# EAGLE design Display (EAGLE 7.7.0)
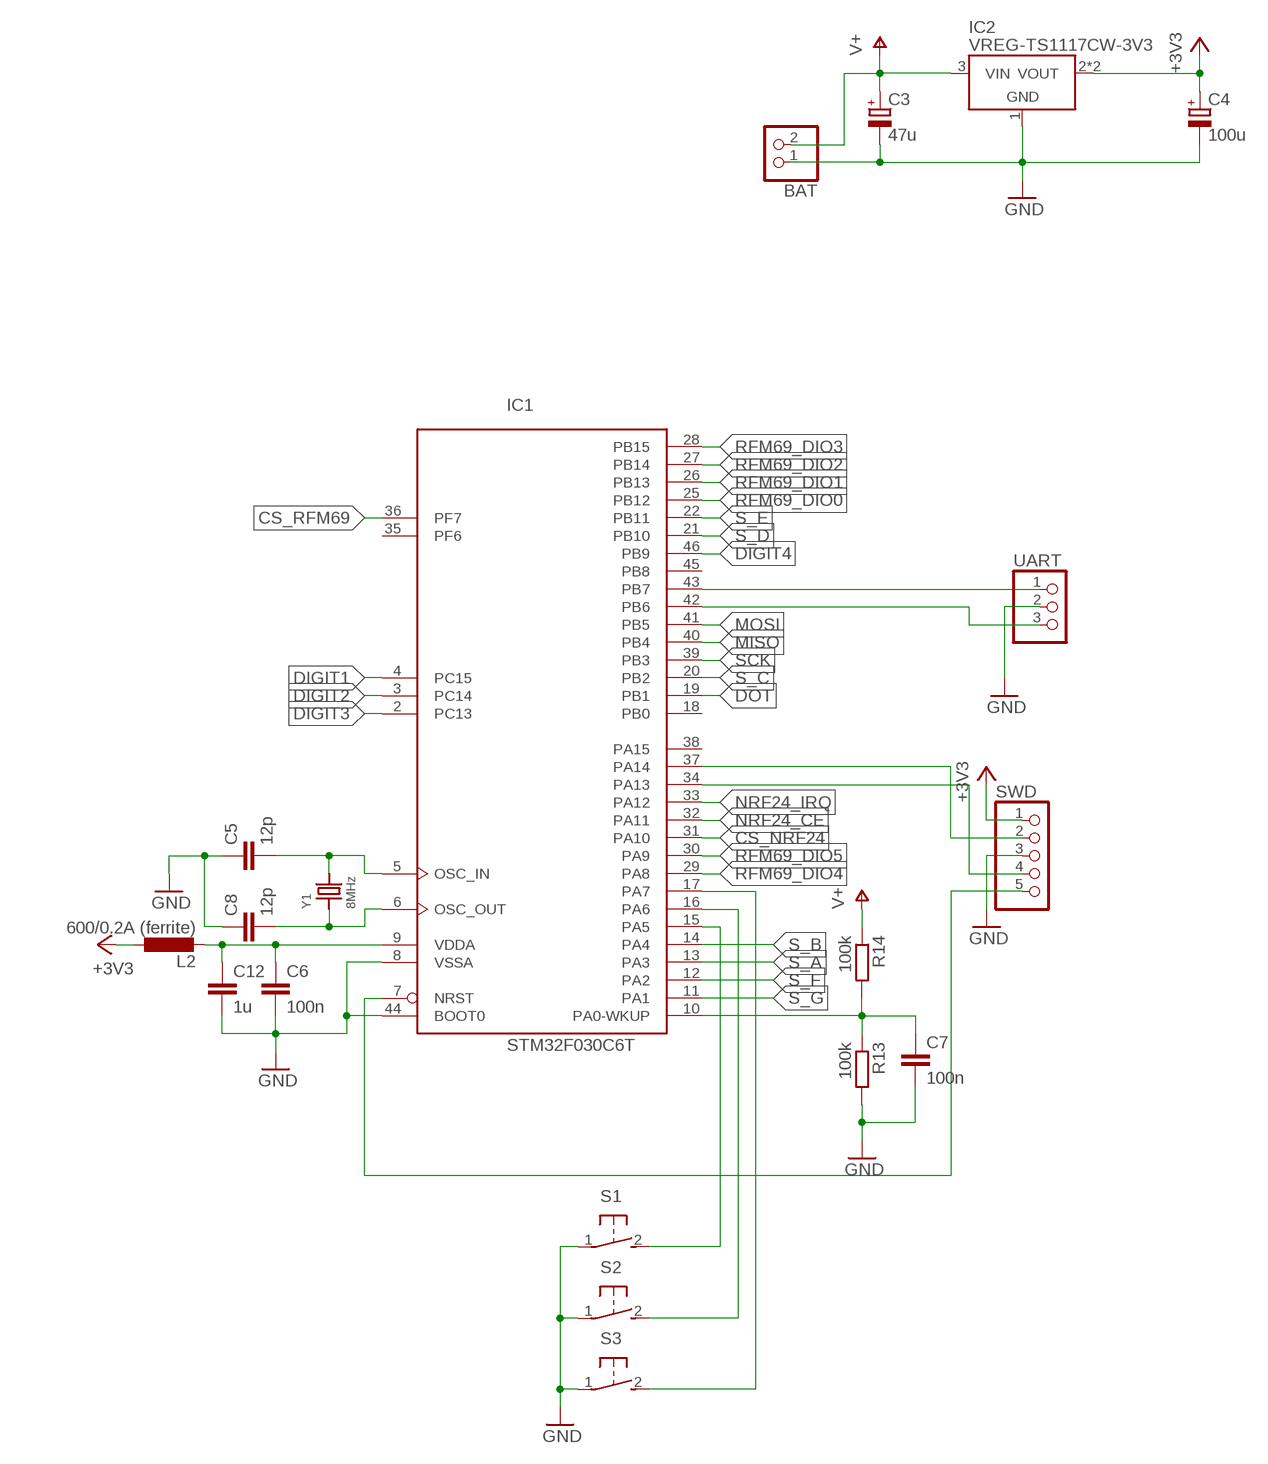
[diagram p0: schematic, sheet 1, part 1 of 2]
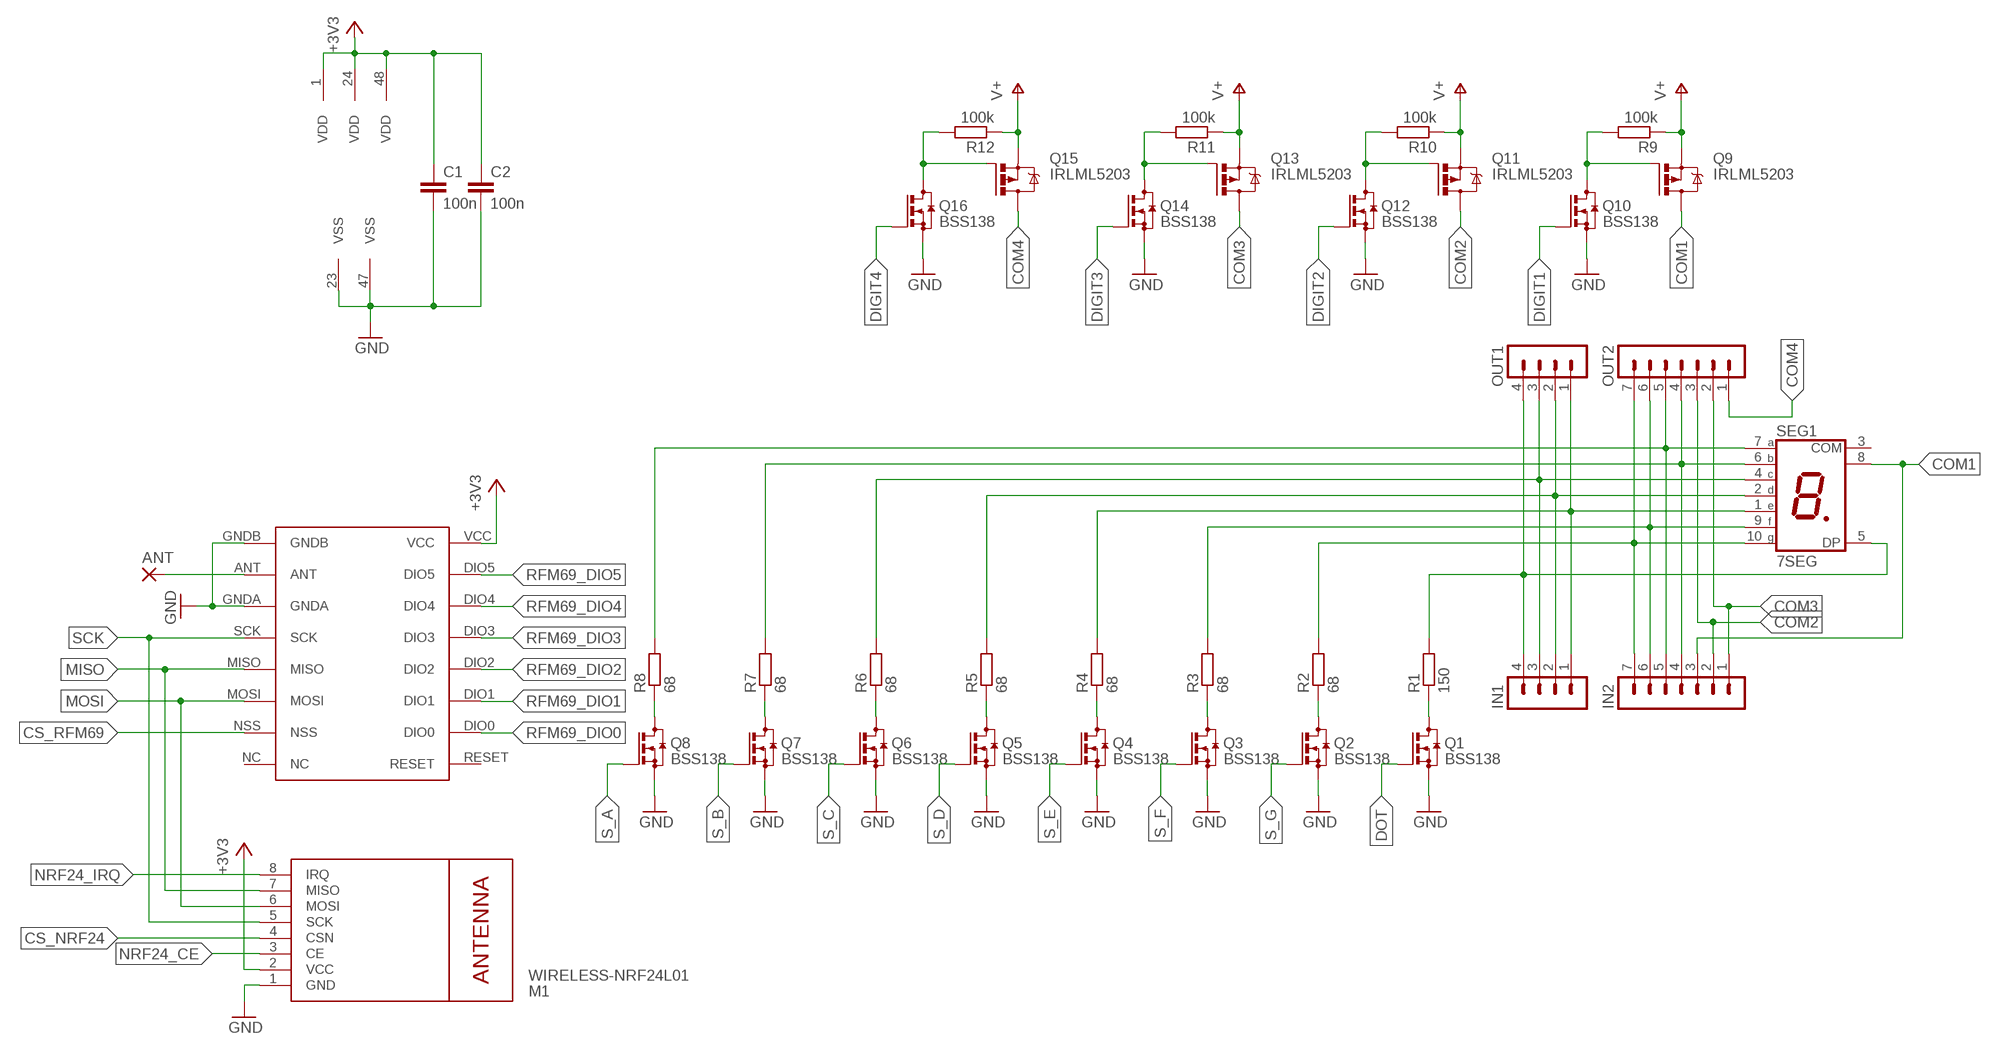
[diagram p1: schematic, sheet 1, part 2 of 2]

## Parts
ANT  1,6/0,8  [1,6/0,8]
BAT  PINHD-1X2/90  [1X02/90]
C1  100n  C-EUC0603K  [C0603K]
C2  100n  C-EUC0603K  [C0603K]
C3  47u  CPOL-EUE2.5-6  [E2,5-6]
C4  100u  CPOL-EUE2.5-6  [E2,5-6]
C5  12p  C-EUC0603  [C0603]
C6  100n  C-EUC0603  [C0603]
C7  100n  C-EUC0603  [C0603]
C8  12p  C-EUC0603  [C0603]
C12  1u  C-EUC0603  [C0603]
IC1  STM32F030C6T  [LQFP48]
IC2  VREG-TS1117CW-3V3  [SOT223]
IN1  MA04-1  [MA04-1]
IN2  MA07-1  [MA07-1]
L2  600/0.2A (ferrite)  L-EUL2012C  [L2012C]
M1  WIRELESS-NRF24L01  [WIRELESS-NRF24L01]
OUT1  MA04-1  [MA04-1]
OUT2  MA07-1  [MA07-1]
Q1  BSS138  BSS123  [SOT23]
Q2  BSS138  BSS123  [SOT23]
Q3  BSS138  BSS123  [SOT23]
Q4  BSS138  BSS123  [SOT23]
Q5  BSS138  BSS123  [SOT23]
Q6  BSS138  BSS123  [SOT23]
Q7  BSS138  BSS123  [SOT23]
Q8  BSS138  BSS123  [SOT23]
Q9  IRLML5203  [MICRO3]
Q10  BSS138  BSS123  [SOT23]
Q11  IRLML5203  [MICRO3]
Q12  BSS138  BSS123  [SOT23]
Q13  IRLML5203  [MICRO3]
Q14  BSS138  BSS123  [SOT23]
Q15  IRLML5203  [MICRO3]
Q16  BSS138  BSS123  [SOT23]
R1  150  R-EU_R1206  [R1206]
R2  68  R-EU_R1206  [R1206]
R3  68  R-EU_R1206  [R1206]
R4  68  R-EU_R1206  [R1206]
R5  68  R-EU_R1206  [R1206]
R6  68  R-EU_R1206  [R1206]
R7  68  R-EU_R1206  [R1206]
R8  68  R-EU_R1206  [R1206]
R9  100k  R-EU_R0603  [R0603]
R10  100k  R-EU_R0603  [R0603]
R11  100k  R-EU_R0603  [R0603]
R12  100k  R-EU_R0603  [R0603]
R13  100k  R-EU_R0603  [R0603]
R14  100k  R-EU_R0603  [R0603]
S1  31-XX  [B3F-31XX]
S2  31-XX  [B3F-31XX]
S3  31-XX  [B3F-31XX]
SEG1  7SEG  [7SEG_70*40]
SWD  PINHD-1X5  [1X05]
U$1  RFM69HW  [RFM]
UART  PINHD-1X3  [1X03]
Y1  8MHz  CRYSTAL.3.2X2.5MM  [3.2X2.5MM]

## Nets
+3V3: C1.1 C2.1 C4.+ IC1.1(VDD) IC1.24(VDD) IC1.48(VDD) IC2.2(VOUT) IC2.4(VOUT) L2.1 M1.2(VCC) SWD.1 U$1.VCC
ANT: ANT.1(P) U$1.ANT
COM1: IN2.3 Q9.3(D) SEG1.8(COM)
COM2: IN2.2 OUT2.3 Q11.3(D)
COM3: IN2.1 OUT2.2 Q13.3(D)
COM4: OUT2.1 Q15.3(D)
CS_NRF24: IC1.31(PA10) M1.4(CSN)
CS_RFM69: IC1.36(PF7) U$1.NSS
DIGIT1: IC1.4(PC15) Q10.1(G)
DIGIT2: IC1.3(PC14) Q12.1(G)
DIGIT3: IC1.2(PC13) Q14.1(G)
DIGIT4: IC1.46(PB9) Q16.1(G)
DOT: IC1.19(PB1) Q1.1(G)
DP: IN1.4 OUT1.4 R1.2 SEG1.5(DP)
GND: BAT.1 C1.2 C2.2 C3.- C4.- C5.1 C6.2 C7.2 C8.1 C12.2 IC1.8(VSSA) IC1.23(VSS) IC1.44(BOOT0) IC1.47(VSS) IC2.1(GND) M1.1(GND) Q1.2(S) Q2.2(S) Q3.2(S) Q4.2(S) Q5.2(S) Q6.2(S) Q7.2(S) Q8.2(S) Q10.2(S) Q12.2(S) Q14.2(S) Q16.2(S) R13.2 S1.1(P) S2.1(P) S3.1(P) SWD.3 U$1.GNDA U$1.GNDB UART.2
MISO: IC1.40(PB4) M1.7(MISO) U$1.MISO
MOSI: IC1.41(PB5) M1.6(MOSI) U$1.MOSI
N$1: Q1.3(D) R1.1
N$2: Q2.3(D) R2.1
N$3: Q3.3(D) R3.1
N$4: Q4.3(D) R4.1
N$5: Q5.3(D) R5.1
N$6: Q6.3(D) R6.1
N$7: Q7.3(D) R7.1
N$8: Q8.3(D) R8.1
N$9: Q9.1(G) Q10.3(D) R9.2
N$10: Q11.1(G) Q12.3(D) R10.2
N$11: Q13.1(G) Q14.3(D) R11.2
N$12: Q15.1(G) Q16.3(D) R12.2
N$13: C6.1 C12.1 IC1.9(VDDA) L2.2
N$14: C7.1 IC1.10(PA0-WKUP) R13.1 R14.2
N$15: C5.2 IC1.5(OSC_IN) Y1.3
N$16: IC1.15(PA5) S1.2(S)
N$17: IC1.16(PA6) S2.2(S)
N$18: IC1.17(PA7) S3.2(S)
N$19: C8.2 IC1.6(OSC_OUT) Y1.1
NRF24_CE: IC1.32(PA11) M1.3(CE)
NRF24_IRQ: IC1.33(PA12) M1.8(IRQ)
NRST: IC1.7(NRST) SWD.5
RFM69_DIO0: IC1.25(PB12) U$1.DIO0
RFM69_DIO1: IC1.26(PB13) U$1.DIO1
RFM69_DIO2: IC1.27(PB14) U$1.DIO2
RFM69_DIO3: IC1.28(PB15) U$1.DIO3
RFM69_DIO4: IC1.29(PA8) U$1.DIO4
RFM69_DIO5: IC1.30(PA9) U$1.DIO5
RX: IC1.43(PB7) UART.1
S_A: IC1.13(PA3) Q8.1(G)
S_B: IC1.14(PA4) Q7.1(G)
S_C: IC1.20(PB2) Q6.1(G)
S_D: IC1.21(PB10) Q5.1(G)
S_E: IC1.22(PB11) Q4.1(G)
S_F: IC1.12(PA2) Q3.1(G)
S_G: IC1.11(PA1) Q2.1(G)
SCK: IC1.39(PB3) M1.5(SCK) U$1.SCK
SEG_A: IN2.5 OUT2.5 R8.2 SEG1.7(A)
SEG_B: IN2.4 OUT2.4 R7.2 SEG1.6(B)
SEG_C: IN1.3 OUT1.3 R6.2 SEG1.4(C)
SEG_D: IN1.2 OUT1.2 R5.2 SEG1.2(D)
SEG_E: IN1.1 OUT1.1 R4.2 SEG1.1(E)
SEG_F: IN2.6 OUT2.6 R3.2 SEG1.9(F)
SEG_G: IN2.7 OUT2.7 R2.2 SEG1.10(G)
SWCLK: IC1.37(PA14) SWD.2
SWDIO: IC1.34(PA13) SWD.4
TX: IC1.42(PB6) UART.3
V+: BAT.2 C3.+ IC2.3(VIN) Q9.2(S) Q11.2(S) Q13.2(S) Q15.2(S) R9.1 R10.1 R11.1 R12.1 R14.1
Unconnected: IC1.18(PB0) IC1.35(PF6) IC1.38(PA15) IC1.45(PB8) SEG1.3(COM) U$1.NC U$1.RESET

## Library data of the parts
ANT = wirepad:1,6/0,8: THROUGH-HOLE PAD
BAT = pinhead:PINHD-1X2: PIN HEADER
C1 C2 C5-C8 C12 = rcl:C-EU: CAPACITOR, European symbol
C3 C4 = rcl:CPOL-EU: POLARIZED CAPACITOR, European symbol
IC1 = micro-stm_v3:STM32F030C*T: ARM 32-bit Cortex™-M0 CPU 48 MHz maximum frequency 32 to 64 Kbytes of Flash memory 4 to 8 kbytes of SRAM 39 GPIOs 2.4 to 3.6 V application supply
IC2 = we-power:VREG: Voltage Regulators (LDOs, Switching Converters...) LDOs Taiwan Semi TS1117 800mA max 15V - compatible On Semi NCP1117 1A max 20V - compatible Diodes AP2111H 0.6A max 6V (0.25V@0.6A) - compatible Diodes AP2114H 1A max 6V (0.45V@1A) Taiwan Semi TS9011 250mA max 12V - compatible Diodes AP2210 300mA max 15V - compatible Microchip MCP1700 250mA max 6.5V - compatible Microchip MCP1702 250mA max 13V - compatible Microchip MCP1703 250mA max 16V - compatible Microchip MCP1754 150mA max 16V Taiwan Semi TS5204 150mA max 16V (low noise) DC/DC Converter Modules Recom R-78Ex.x-1.0-W36 1A max 28V - compatible CUI V78xx-2000 2A max 18V Murata OKI-78SR-x.x/1.5-W36 1.5A max 36V
IN1 OUT1 = con-lstb:MA04-1: PIN HEADER; OC_FARNELL: unknown; OC_NEWARK: unknown
IN2 OUT2 = con-lstb:MA07-1: PIN HEADER; OC_FARNELL: unknown; OC_NEWARK: unknown
L2 = rcl:L-EU: INDUCTOR, European symbol
M1 = diy-modules:WIRELESS-NRF24L01: 2.4 GHz Wireless Module based on NRF24L01 chip More details available here: http://www.electrodragon.com/w/NRF24L01 Click here to find device on ebay.com <http://www.ebay.com/sch/nrf24l01+arduino>
Q1-Q8 Q10 Q12 Q14 Q16 = transistor-small-signal:BSS123: N-CHANNEL MOS FET
Q9 Q11 Q13 Q15 = transistor-power:IRLML5203: HEXFET P-Channel Power MOSFET
R1-R8 = rcl:R-EU_: RESISTOR, European symbol
R9-R14 = resistor:R-EU_: RESISTOR, European symbol
S1-S3 = switch-omron:31-XX: OMRON SWITCH; MPN: B3F-3100; OC_FARNELL: 959704; OC_NEWARK: 36M3582
SEG1 = display-custom:7SEG
SWD = pinhead:PINHD-1X5: PIN HEADER
U$1 = hoperf:RFM69HW
UART = pinhead:PINHD-1X3: PIN HEADER
Y1 = abracon:CRYSTAL

## Board
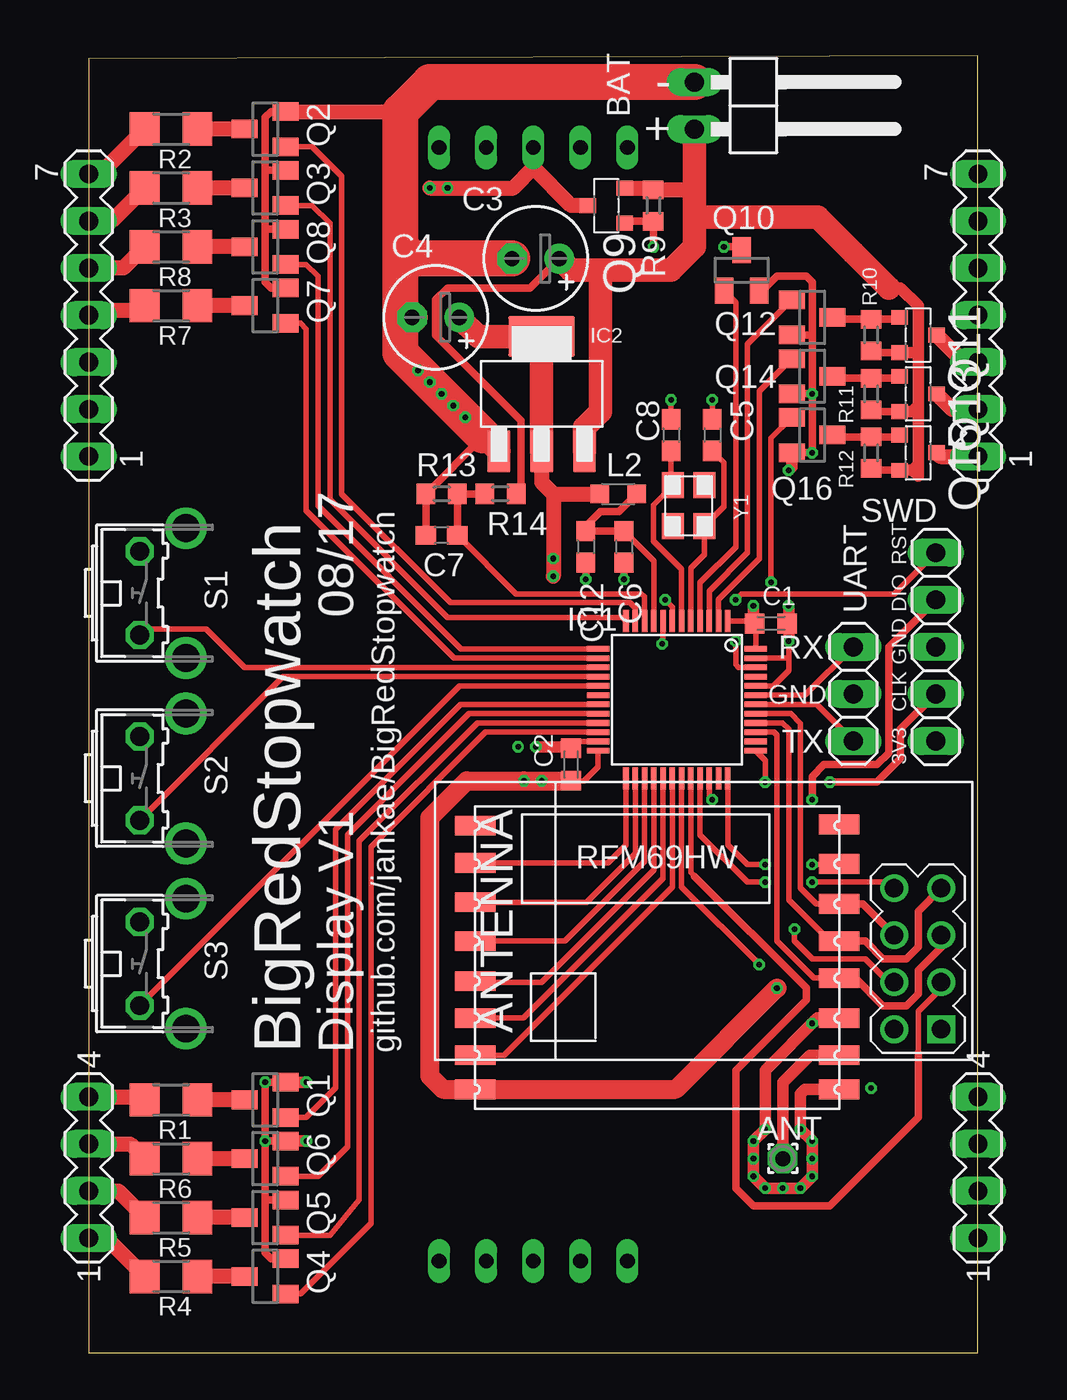
[diagram p2: board, top side]
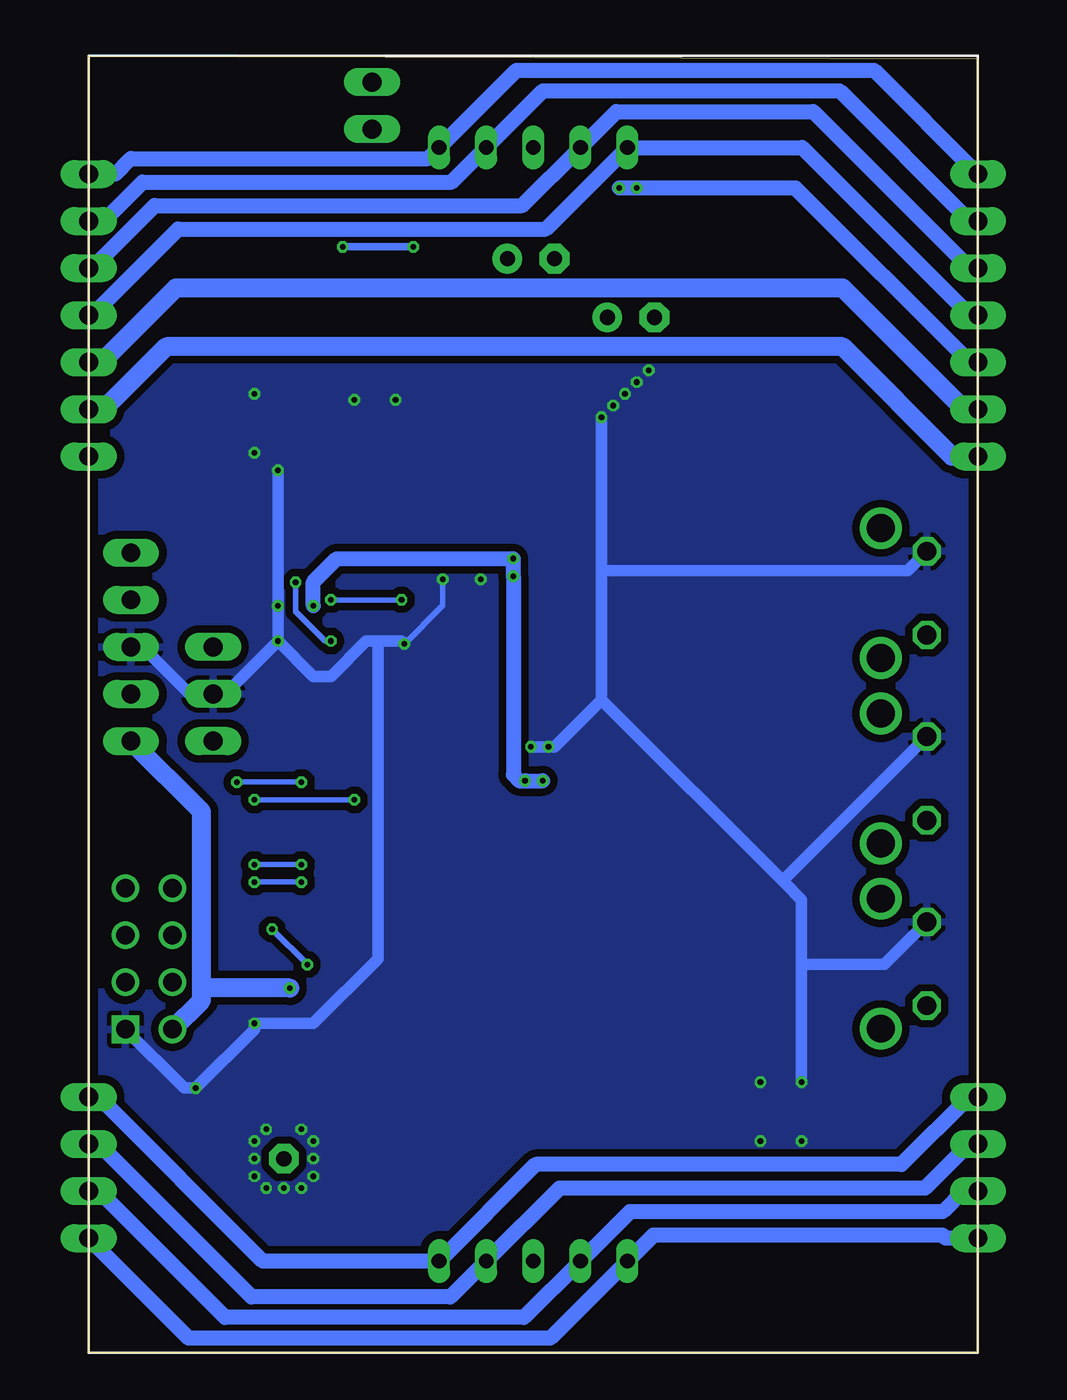
[diagram p3: board, bottom side, seen from below]

Size 48 x 70 mm. Coordinates in mm from the lower left corner, seen from the top.
Outline: 0,0 48,0 48,70 0,69.84 0,0
Copper layers (1*16): Top 0.035mm / dielectric 1.6mm / Bottom 0.035mm
Design rules "Elecrow_2-layer_PCB_eagle_rule": minimum track width 6mil, minimum drill 12mil, track to track 6mil, track to pad 6mil, pad to pad 6mil, via to via 8mil, smd to smd 0mil, copper to edge 20mil, drill to drill 10mil, minimum pad ring 6mil, minimum via ring 6mil, stop-mask expansion 0mil, vias tented up to drill 100mil, thermal gap 10mil

### Footprints (pad centres in the part's own frame; a part is rotated, then mirrored left to right if it is on the bottom)
1,6/0,8 = drill 0.813 pad 1.6 octagon: 1 0,0
1X02/90 = drill 1.016 long: 1 -1.27,-3.81; 2 1.27,-3.81
C0603K = smd 1.05 x 1.08: 1 -0.875,0; 2 0.875,0
E2,5-6 = drill 0.813 pad 1.6: + -1.27,0 | drill 0.813 pad 1.6 octagon: - 1.27,0
C0603 = smd 1.1 x 1: 1 -0.85,0; 2 0.85,0
LQFP48 = smd 0.3 x 1.2: 1 -2.75,-4.25; 2 -2.25,-4.25; 3 -1.75,-4.25; 4 -1.25,-4.25; 5 -0.75,-4.25; 6 -0.25,-4.25; 7 0.25,-4.25; 8 0.75,-4.25; 9 1.25,-4.25; 10 1.75,-4.25; 11 2.25,-4.25; 12 2.75,-4.25; 25 2.75,4.25; 26 2.25,4.25; 27 1.75,4.25; 28 1.25,4.25; 29 0.75,4.25; 30 0.25,4.25; 31 -0.25,4.25; 32 -0.75,4.25; 33 -1.25,4.25; 34 -1.75,4.25; 35 -2.25,4.25; 36 -2.75,4.25 | smd 1.2 x 0.3: 13 4.25,-2.75; 14 4.25,-2.25; 15 4.25,-1.75; 16 4.25,-1.25; 17 4.25,-0.75; 18 4.25,-0.25; 19 4.25,0.25; 20 4.25,0.75; 21 4.25,1.25; 22 4.25,1.75; 23 4.25,2.25; 24 4.25,2.75; 37 -4.25,2.75; 38 -4.25,2.25; 39 -4.25,1.75; 40 -4.25,1.25; 41 -4.25,0.75; 42 -4.25,0.25; 43 -4.25,-0.25; 44 -4.25,-0.75; 45 -4.25,-1.25; 46 -4.25,-1.75; 47 -4.25,-2.25; 48 -4.25,-2.75
SOT223 = smd 2.235 x 1.219: 1 -3.099,2.311; 2 -3.099,0; 3 -3.099,-2.311 | smd 2.2 x 3.6: 4 3.099,0
MA04-1 = drill 1.016 long: 1 -3.81,0; 2 -1.27,0; 3 1.27,0; 4 3.81,0
MA07-1 = drill 1.016 long: 1 -7.62,0; 2 -5.08,0; 3 -2.54,0; 4 0,0; 5 2.54,0; 6 5.08,0; 7 7.62,0
L2012C = smd 1 x 1: 1 -1,0; 2 1,0
WIRELESS-NRF24L01 = drill 1 square: 1 -12.7,6.35 | drill 1: 2 -10.16,6.35; 3 -12.7,3.81; 4 -10.16,3.81; 5 -12.7,1.27; 6 -10.16,1.27; 7 -12.7,-1.27; 8 -10.16,-1.27
SOT23 = smd 1 x 1.4: 1 -0.95,-1.1; 2 0.95,-1.1; 3 0,1.1
MICRO3 = smd 0.8 x 0.9: 1 -0.95,-1; 2 0.95,-1; 3 0,1
R1206 = smd 1.6 x 1.803: 1 -1.422,0; 2 1.422,0
R0603 = smd 1 x 1.1: 1 -0.85,0; 2 0.85,0
B3F-31XX = drill 1.016 octagon: 1 -2.261,-1.245; 2 2.261,-1.245 | drill 1.499 pad 2.159: 3 -3.505,1.245; 4 3.505,1.245
7SEG_70*40 = drill 0.8 long: 1 5.08,-30.05; 2 2.54,-30.05; 3 0,-30.05; 4 -2.54,-30.05; 5 -5.08,-30.05; 6 5.08,30.05; 7 2.54,30.05; 8 0,30.05; 9 -2.54,30.05; 10 -5.08,30.05
1X05 = drill 1.016 long: 1 -5.08,0; 2 -2.54,0; 3 0,0; 4 2.54,0; 5 5.08,0
RFM = smd 2.184 x 1.067: ANT 19.651,2.889; DIO0 0,13.27; DIO1 0,11.143; DIO2 0,9.047; DIO3 0,6.889; DIO4 0,4.889; DIO5 0,2.889; GNDA 19.651,4.889; GNDB 19.651,1.048; MISO 19.651,9.047; MOSI 19.651,11.047; NC 19.651,15.334; NSS 19.651,13.206; RESET 0,15.27; SCK 19.651,7.048; VCC 0,1.048
1X03 = drill 1.016 long: 1 -2.54,0; 2 0,0; 3 2.54,0
3.2X2.5MM = smd 1.4 x 1.2: 1 -1.1,-0.85; 2 1.1,-0.85; 3 1.1,0.85; 4 -1.1,0.85

### Placement (x,y rotation side)
ANT  37.47,10.48 0 top
BAT  36.51,67.31 270 top
C1  36.83,39.37 0 top
C2  26.04,31.75 90 top
C3  24.13,59.05 180 top
C4  18.73,55.88 180 top
C5  33.66,49.53 270 top
C6  28.89,43.5 270 top
C7  19.05,44.13 180 top
C8  31.43,49.53 270 top
C12  26.83,43.5 270 top
IC1  31.75,35.24 180 top
IC2  24.45,51.75 90 top
IN1  0,10 90 top
IN2  0,56 90 top
L2  28.57,46.35 0 top
M1  33.32,23.81 180 top
OUT1  48,10 90 top
OUT2  48,56 90 top
Q1  9.53,13.65 90 top
Q2  9.53,66.04 90 top
Q3  9.53,62.87 90 top
Q4  9.53,4.13 90 top
Q5  9.53,7.3 90 top
Q6  9.53,10.48 90 top
Q7  9.53,56.52 90 top
Q8  9.53,59.69 90 top
Q9  27.94,61.91 90 top
Q10  35.24,58.42 0 top
Q11  44.77,54.93 270 top
Q12  39.05,55.88 270 top
Q13  44.77,51.75 270 top
Q14  39.05,52.7 270 top
Q15  44.77,48.58 270 top
Q16  39.05,49.53 270 top
R1  4.45,13.65 180 top
R2  4.45,66.04 180 top
R3  4.45,62.87 180 top
R4  4.45,4.13 180 top
R5  4.45,7.3 180 top
R6  4.45,10.48 180 top
R7  4.45,56.52 180 top
R8  4.45,59.69 180 top
R9  30.48,61.91 270 top
R10  42.23,54.93 90 top
R11  42.23,51.75 90 top
R12  42.23,48.58 90 top
R13  19.05,46.35 180 top
R14  22.23,46.35 180 top
S1  4,41 270 top
S2  4,31 270 top
S3  4,21 270 top
SEG1  24,35 0 bottom
SWD  45.72,38.1 90 top
U$1  20.86,13.18 0 top
UART  41.27,35.56 270 top
Y1  32.38,45.72 270 top

### Tracks (layer width: path | path; a pad name or v marks a point on that pad's centre or on a via)
+3V3  (via drill 0.3)
  Top 0.305: IC1.24 27.5,31.63 26.75,30.88 C2.1 | IC1.48 36,39.33 C1.1 35.83,39.49 IC1.1 35.68,39.49 35.88,39.69
  Top 0.61: 35.88,39.69 v35.88,40.32
  Top 0.813: IC2.2 24.45,46.99 25.08,46.35 | 25.08,46.35 L2.1 | 25.08,46.35 v25.08,41.91
  Top 1.016: C2.1 v23.5,30.88 20.4,30.88 18.41,28.89 18.41,14.92 19.11,14.22 U$1.VCC 31.68,14.22 v37.15,19.68
  Top 1.27: IC2.2 IC2.4 21.03,54.85 C4.+
  Bottom 0.813: v23.5,30.88 v24.45,30.88 24.77,30.88 25.08,31.19 v25.08,41.91 v25.08,42.86 34.61,42.86 35.88,41.59 v35.88,40.32
  Bottom 1.016: M1.2 41.91,19.03 41.91,19.68 | 41.91,19.68 41.91,29.21 SWD.1 | v37.15,19.68 41.91,19.68
ANT
  Top 0.61: U$1.ANT 38.92,16.06 37.47,14.61 ANT.1
COM1  (via drill 0.3)
  Top 0.813: Q9.3 26.04,61.91 24,63.95 | 24,63.95 SEG1.8 | v18.41,62.87 22.92,62.87 24,63.95
  Bottom 0.813: IN2.3 0.44,53.46 9.84,62.87 v18.41,62.87 | v18.41,62.87 v19.37,62.87 v18.41,62.87
COM2
  Top 0.813: Q11.3 47.23,53.46 OUT2.3
  Bottom 1.016: IN2.2 0.76,50.92 7.3,57.47 43.3,57.47 47.31,53.46 OUT2.3
COM3
  Top 0.813: Q13.3 46.6,50.92 OUT2.2
  Bottom 1.016: IN2.1 1.39,48.38 7.3,54.29 43.81,54.29 47.19,50.92 OUT2.2
COM4
  Top 0.813: Q15.3 45.97,48.38 OUT2.1
CS_NRF24  (via drill 0.3)
  Top 0.305: M1.4 43.18,20 41.91,21.27 39.05,21.27 38.1,22.23 v38.1,22.86 | v36.2,20.95 32,25.15 IC1.31
  Bottom 0.305: v38.1,22.86 v36.2,20.95
CS_RFM69  (via drill 0.3)
  Top 0.305: U$1.NSS 40.48,26.35 v39.05,26.35 | v36.51,26.35 35.56,26.35 34.5,27.41 IC1.36
  Bottom 0.305: v39.05,26.35 v36.51,26.35
DIGIT1
  Top 0.305: IC1.4 33,41.57 34.92,43.5 34.92,56.69 Q10.1
DIGIT2
  Top 0.305: IC1.3 33.5,41.12 35.56,43.18 35.56,54.44 Q12.1
DIGIT3
  Top 0.305: IC1.2 34,40.67 36.2,42.86 36.2,51.9 Q14.1
DIGIT4  (via drill 0.3)
  Top 0.305: Q16.1 36.83,49.36 v36.83,41.59 | v34.92,38.42 34.92,37.15 35.08,36.99 IC1.46
  Bottom 0.305: v36.83,41.59 36.83,40.01 35.24,38.42 v34.92,38.42
DOT
  Top 0.305: IC1.19 20.07,34.99 13.34,28.26 13.34,14.29 11.75,12.7 Q1.1
DP
  Top 0.813: IN1.4 2.87,13.81 R1.2
  Bottom 0.813: IN1.4 0.48,13.81 4.13,10.16 23.87,10.16 SEG1.5 38.6,4.95 47.47,13.81 OUT1.4
GND  (via drill 0.3)
  Top 0.305: IC1.23 26.4,32.99 C2.2 | IC1.44 36.95,35.99 37.78,36.83 37.78,37.47 | 37.78,37.47 v37.78,38.42 | IC1.47 37.76,37.49 37.78,37.47 | IC1.8 31,38.3 v30.96,38.26 | C5.1 v33.66,51.44 | C8.1 v31.43,51.44
  Top 0.406: C7.2 R13.2 21.27,49.42 21.27,49.52 | Q7.2 9.85,57.47 9.53,57.78 9.53,60.64 | 9.53,60.64 9.53,63.82 | 9.53,63.82 9.53,66.67 9.84,66.99 Q2.2 | Q3.2 9.53,63.81 9.53,63.82 | Q8.2 9.53,60.64 | Q4.2 9.85,5.08 9.53,5.4 9.53,8.26 | 9.53,8.26 v9.53,11.43 | v9.53,11.43 v9.53,14.61 Q1.2 | Q6.2 v9.53,11.43 | Q5.2 9.53,8.25 9.53,8.26 | Q10.2 36.37,57.32 37.15,58.1 38.73,58.1 39.05,57.78 39.05,54.93 | 39.05,54.93 v39.05,51.75 | v39.05,51.75 v39.05,48.58 Q16.2 | Q14.2 v39.05,51.76 v39.05,51.75 | Q12.2 39.05,54.93 | 16.83,53.96 17.78,53.96 v17.78,53.02 | C12.2 v26.83,41.75 | C6.2 v28.89,41.75
  Top 0.61: U$1.GNDB 38.67,14.22 38.42,13.97 v38.42,12.06 v39.05,11.43 v39.05,10.48 v39.05,9.53 v38.42,8.89 v37.47,8.89 v36.51,8.89 v35.88,9.53 v35.88,10.48 v35.88,11.43 v36.51,12.06 36.51,15.24 39.34,18.06 U$1.GNDA | 17.46,53.33 17.77,53.02 v17.78,53.02 v18.41,52.39 v19.05,51.75 v19.68,51.12 v20.32,50.48 | C2.2 25.96,32.7 v24.13,32.7 | Q1.2 v11.75,14.61 | Q6.2 v11.75,11.43 | v37.78,38.42 v37.78,40.32 37.78,39.45 C1.2 | Q16.2 37.95,47.8 v37.78,47.62
  Top 0.813: Q2.2 16.83,66.99 17.14,66.99
  Top 1.27: 21.27,49.52 IC2.1
  Top 1.676: C4.- 16.83,55.88
  Top 1.93: BAT.1 18.42,68.58 16.83,66.99 16.83,59.69 | C3.- 17.46,59.05 16.83,59.69 | 16.83,59.69 16.83,55.88 16.83,53.96 21.27,49.52
  Bottom 0.305: v30.96,38.26 28.89,40.32 v28.89,41.75
  Bottom 0.61: v24.13,32.7 v23.18,32.7 22.86,32.7 20.32,35.24 | 20.32,35.24 20.32,42.23 | 20.32,42.23 v20.32,50.48 | v9.53,14.61 9.53,20.95 | 9.53,20.95 9.53,24.45 10.48,25.4 | 10.48,25.4 20.32,35.24 | S3.1 5.06,20.95 9.53,20.95 | S2.1 10.48,25.54 10.48,25.4 | S1.1 3.79,42.23 20.32,42.23 | SWD.3 45.09,38.1 42.55,35.56 UART.2 40.64,35.56 v37.78,38.42 | v37.78,38.42 v37.78,40.32 v37.78,47.62 | M1.1 42.85,14.29 v42.23,14.29 39.05,17.46 v39.05,17.78 35.88,17.78 32.38,21.27 32.38,38.42 | v37.78,38.42 35.88,36.51 34.92,36.51 33.02,38.42 31.11,38.42 v30.96,38.26
  pour Bottom (isolate 0.406): -0.64,54.61 49.85,54.61 49.85,-1.91 -0.64,-1.91
MISO
  Top 0.305: U$1.MISO 40.01,22.22 37.78,24.45 37.78,33.66 37.45,33.99 IC1.40
  Top 0.406: U$1.MISO 41.91,22.22 42.86,21.27 44.13,21.27 44.77,21.91 44.77,23.83 M1.7
MOSI
  Top 0.305: U$1.MOSI 39.28,24.22 38.42,25.08 38.42,33.97 37.9,34.49 IC1.41
  Top 0.406: U$1.MOSI 41.8,24.22 M1.6
N$1
  Top 0.813: Q1.3 R1.1
N$2
  Top 0.813: Q2.3 R2.1
N$3
  Top 0.813: Q3.3 R3.1
N$4
  Top 0.813: Q4.3 R4.1
N$5
  Top 0.813: Q5.3 R5.1
N$6
  Top 0.813: Q6.3 R6.1
N$7
  Top 0.813: Q7.3 R7.1
N$8
  Top 0.813: Q8.3 R8.1
N$9  (via drill 0.3)
  Top 0.406: Q9.1 29.04,61.06 R9.2 v30.48,59.69 | v34.29,59.69 35.07,59.69 Q10.3
  Bottom 0.406: v30.48,59.69 v34.29,59.69
N$10
  Top 0.406: Q12.3 40.26,55.78 R10.2 43.67,55.78 Q11.1
N$11
  Top 0.406: Q13.1 43.67,52.6 R11.2 40.26,52.6 Q14.3
N$12
  Top 0.406: Q15.1 43.67,49.43 R12.2 40.26,49.43 Q16.3
N$13
  Top 0.305: IC1.9 30.5,42.74 C6.1
  Top 0.406: 29.63,46.3 L2.2 28.62,45.4 27.62,45.4 26.83,44.61 C12.1 C6.1
N$14
  Top 0.305: IC1.10 30,40.8 29.84,40.96 23.07,40.96 C7.1
  Top 0.406: C7.1 R13.1 R14.2
N$15
  Top 0.305: IC1.5 32.5,42.34 33.23,43.08 Y1.3 34.29,45.67 34.29,48.05 C5.2
N$16
  Top 0.305: IC1.15 8.41,36.99 6.35,39.05 3.07,39.05 S1.2
N$17
  Top 0.305: IC1.16 10.51,36.49 S2.2
N$18
  Top 0.305: IC1.17 20.01,35.99 S3.2
N$19
  Top 0.305: IC1.6 32,42.3 30.48,43.81 30.48,45.77 Y1.1 31.43,46.92 C8.2
NRF24_CE
  Top 0.305: M1.3 46.02,19.67 44.77,18.41 44.77,16.19 | IC1.32 32.5,25.92 32.7,25.72
  Top 0.406: 44.77,16.19 44.77,12.7 40.01,7.94 35.88,7.94 34.92,8.89 34.92,15.24 38.73,19.05 38.73,19.68 32.7,25.72
NRF24_IRQ  (via drill 0.3)
  Top 0.305: M1.8 43.16,25.4 v39.05,25.4 | v36.51,25.4 35.56,25.4 33,27.96 IC1.33
  Bottom 0.305: v39.05,25.4 v36.51,25.4
NRST  (via drill 0.3)
  Top 0.305: IC1.7 31.5,40.26 v31.11,40.64 | v34.92,40.64 35.24,40.96 43.5,40.96 SWD.5
  Bottom 0.305: v31.11,40.64 v34.92,40.64
RFM69_DIO0
  Top 0.305: U$1.DIO0 28.03,26.45 29,27.41 IC1.25
RFM69_DIO1
  Top 0.305: U$1.DIO1 26.86,24.32 29.5,26.96 IC1.26
RFM69_DIO2
  Top 0.305: IC1.27 30,26.51 25.72,22.23 U$1.DIO2
RFM69_DIO3
  Top 0.305: IC1.28 30.5,26.05 24.45,20 20.92,20 U$1.DIO3
RFM69_DIO4
  Top 0.305: IC1.29 31,25.6 23.46,18.06 U$1.DIO4
RFM69_DIO5
  Top 0.305: IC1.30 31.5,25.15 22.41,16.06 U$1.DIO5
RX
  Top 0.305: IC1.43 38.67,35.49 UART.1
S_A
  Top 0.305: Q8.1 11.74,58.74 12.38,58.1 12.38,45.72 20.11,37.99 IC1.13
S_B
  Top 0.305: Q7.1 11.43,55.56 11.75,55.24 11.75,45.46 19.71,37.49 IC1.14
S_C
  Top 0.305: IC1.20 20.52,34.49 13.97,27.94 13.97,11.11 12.38,9.53 Q6.1
S_D
  Top 0.305: IC1.21 20.98,33.99 14.61,27.62 14.61,8.26 13.02,6.35 Q5.1
S_E
  Top 0.305: IC1.22 21.43,33.49 15.24,27.3 15.24,6.99 11.43,3.17 Q4.1
S_F
  Top 0.305: Q3.1 12.06,61.91 13.02,60.96 13.02,46.04 19.37,39.69 28.8,39.69 IC1.12
S_G
  Top 0.305: IC1.11 29.5,40.19 29.21,40.48 19.53,40.48 13.65,46.35 13.65,63.5 12.06,65.09 Q2.1
SCK
  Top 0.305: U$1.SCK 39.15,20.22 37.15,22.23 37.15,33.34 36.99,33.49 IC1.39
  Top 0.406: U$1.SCK 41.37,20.22 42.86,18.73 44.13,18.73 44.77,19.37 44.77,20.64 46.04,21.91 46.04,22.52 M1.5
SEG_A
  Top 0.813: R8.2 1.87,58.54 IN2.5
  Bottom 0.813: IN2.5 0.44,58.54 8.89,66.99 19.52,66.99 SEG1.7 24.6,61.91 44.45,61.91 47.82,58.54 OUT2.5
SEG_B
  Top 0.813: R7.2 2.78,56.27 0.71,56.27 0.44,56 IN2.4
  Bottom 0.813: IN2.4 0.44,56 9.49,65.05 SEG1.6 23.33,60.64 43.18,60.64 47.82,56 OUT2.4
SEG_C
  Top 0.813: IN1.3 2.23,11.27 R6.2
  Bottom 0.813: IN1.3 0.48,11.27 2.86,8.89 22.6,8.89 SEG1.4 28.47,3.02 39.21,3.02 47.47,11.27 OUT1.3
SEG_D
  Top 0.813: IN1.2 1.59,8.73 R5.2
  Bottom 0.813: IN1.2 0.8,8.73 1.91,7.62 18.79,7.62 SEG1.2 24.5,1.91 40.64,1.91 47.47,8.73 OUT1.2
SEG_E
  Top 0.813: IN1.1 0.96,6.19 R4.2
  Bottom 0.813: IN1.1 1.75,6.19 1.91,6.35 17.52,6.35 SEG1.1 23.08,0.79 42.6,0.79 OUT1.1
SEG_F
  Top 0.813: R3.2 1.24,61.08 IN2.6
  Bottom 0.813: IN2.6 0.44,61.08 7.46,68.1 23.49,68.1 SEG1.9 28.41,63.18 45.09,63.18 47.19,61.08 OUT2.6
SEG_G
  Top 0.813: R2.2 0.6,63.62 IN2.7
  Bottom 0.813: IN2.7 5.59,69.22 24.91,69.22 SEG1.10 29.68,64.45 45.72,64.45 46.55,63.62 OUT2.7
SWCLK  (via drill 0.3)
  Top 0.305: IC1.37 36.51,31.98 v36.51,30.8
  Top 0.406: v40.01,30.8 42.55,30.8 43.81,32.07 43.81,33.66 SWD.2
  Bottom 0.305: v36.51,30.8 v40.01,30.8
SWDIO  (via drill 0.3)
  Top 0.305: IC1.34 33.5,30 v33.66,29.84
  Top 0.406: v39.05,29.84 39.05,31.11 39.69,31.75 42.55,31.75 43.18,32.38 43.18,38.1 SWD.4
  Bottom 0.305: v33.66,29.84 v39.05,29.84
TX
  Top 0.305: IC1.42 39.3,34.99 UART.3
V+
  Top 0.406: R14.1 23.34,46.62 23.34,50.32 18.73,54.93 18.73,56.83 19.37,57.47 23.81,57.47 C3.+ | Q11.2 42.33,53.98 R10.1 | Q13.2 42.33,50.8 R11.1 | Q15.2 42.33,47.63 R12.1
  Top 0.61: 44.77,53.98 44.77,56.52 43.81,57.47 43.18,57.47 | Q11.2 44.77,53.98 | Q13.2 44.45,50.8 44.77,51.12 | Q15.2 44.45,47.63 44.45,47.62 | 44.45,47.62 44.77,47.31 44.77,51.12 | 44.77,47.94 44.45,47.62 | 44.77,51.12 44.77,53.98 | 41.27,59.37 41.27,59.05 41.59,58.74 42.23,58.74 42.23,58.1 42.86,58.1
  Top 0.813: Q9.2 30.38,62.86 R9.1 32.6,62.76 32.7,62.87
  Top 1.27: IC2.3 26.76,49.94 27.62,50.8 27.62,58.1 27.3,58.42 | 27.3,58.42 31.43,58.42 32.7,59.69 32.7,61.28 | 27.3,58.42 26.04,58.42 C3.+ | BAT.2 32.7,62.87 32.7,61.28 | 32.7,61.28 39.37,61.28 41.27,59.37 43.18,57.47

### Text on the board
tPlace: - | + | RST | 08/17 | DIO | RX | GND | GND | CLK | TX | 3V3 | BigRedStopwatch | Display V1 | github.com/jankae/BigRedStopwatch